# Altium schematic sheet Sheet2.SchDoc
size A; SheetNumber: 1; SheetTotal: 1
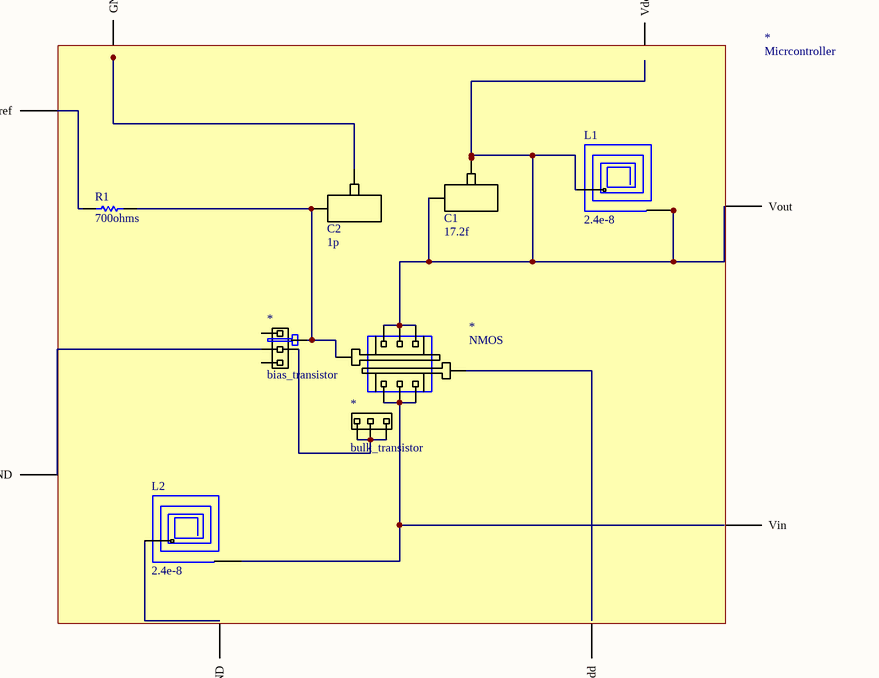
[diagram p0: Sheet2.SchDoc]

## Parts
(Parts that share a designator on the sheet are numbered #1, #2 ... from top to bottom, then left to right.)
*#1  Micrcontroller
*#2  bias_transistor
*#3  NMOS
*#4  bulk_transistor
C1  17.2f  [Capacitor]
C2  1p  [Capacitor]
L1  2.4e-8
L2  2.4e-8
R1  700ohms  [RESC1005X40X25LL05T05]

## Nets
Net*#1_6: *#1.6(GND) *#2.13
Net*#1_6: *#1.6(Iref) R1.1  [a separate net that carries the same name]
Net*#1_6: *#1.6(Vout) *#1.?2(Vdd) *#3.13 C1.13 L1.13  [a separate net that carries the same name]
Net*#1_6: *#1.6(Vin) *#3.13 L2.13  [a separate net that carries the same name]
Net*#1_6: *#1.6(GND) L2.13  [a separate net that carries the same name]
Net*#1_6: *#1.6(Vdd) *#3.13  [a separate net that carries the same name]
Net*#1_?1: *#1.?1(GND) C2.13
Net*#2_13: *#2.13 *#3.13 C2.13 R1.2
Net*#2_13: *#2.13 *#4.13  [a separate net that carries the same name]

## Library data of the parts
C1 C2 = Capacitor
L1 L2 = Inductor
R1 = CMP-2000-07451-1: Chip Resistor, 0 Ohm, 0.1 W, -55 to 155 degC, 0402 (1005 Metric), RoHS, Tape and Reel; Manufacturer: Panasonic; Voltage Rating (DC): 50V; Temperature Coefficient: 600ppm/��C; Max Power Dissipation: 100mW; Resistance: 0mOhm; Tolerance: 5%; Number of Terminations: 2; Mount: SurfaceMount; Height: 0.35mm; Packaging: TapeandReel; Contact Plating: Tin; Manufacturer URL: http://www.panasonic.com/; Composition: ThickFilm; Max Operating Temperature: 155degC; REACH SVHC: NoSVHC; Case/Package: 0402; Package Reference: 402; Depth: 0.5mm; Package Description: 2-Pin Surface Mount Device, Body 1 x 0.5 mm; Datasheet URL: https://industrial.panasonic.com/cdbs/www-data/pdf/RDA0000/AOA0000C301.pdf; RoHSCompliant: True; Case Code (Imperial): 0402; Military Standard: Not; Min Operating Temperature: -55degC; Power Rating: 100mW; Datasheet Version: 03/2015; Length: 1mm; Case Code (Metric): 1005; Termination: SMD/SMT; Mounting Technology: SurfaceMount; Voltage Rating: 50V; Width: 0.02inch; Package Quantity: 1; Lead Free: LeadFree; Radiation Hardening: No